# Altium schematic sheet Микроконтроллер_2024-10-30.schdoc
size 295 x 185 mm
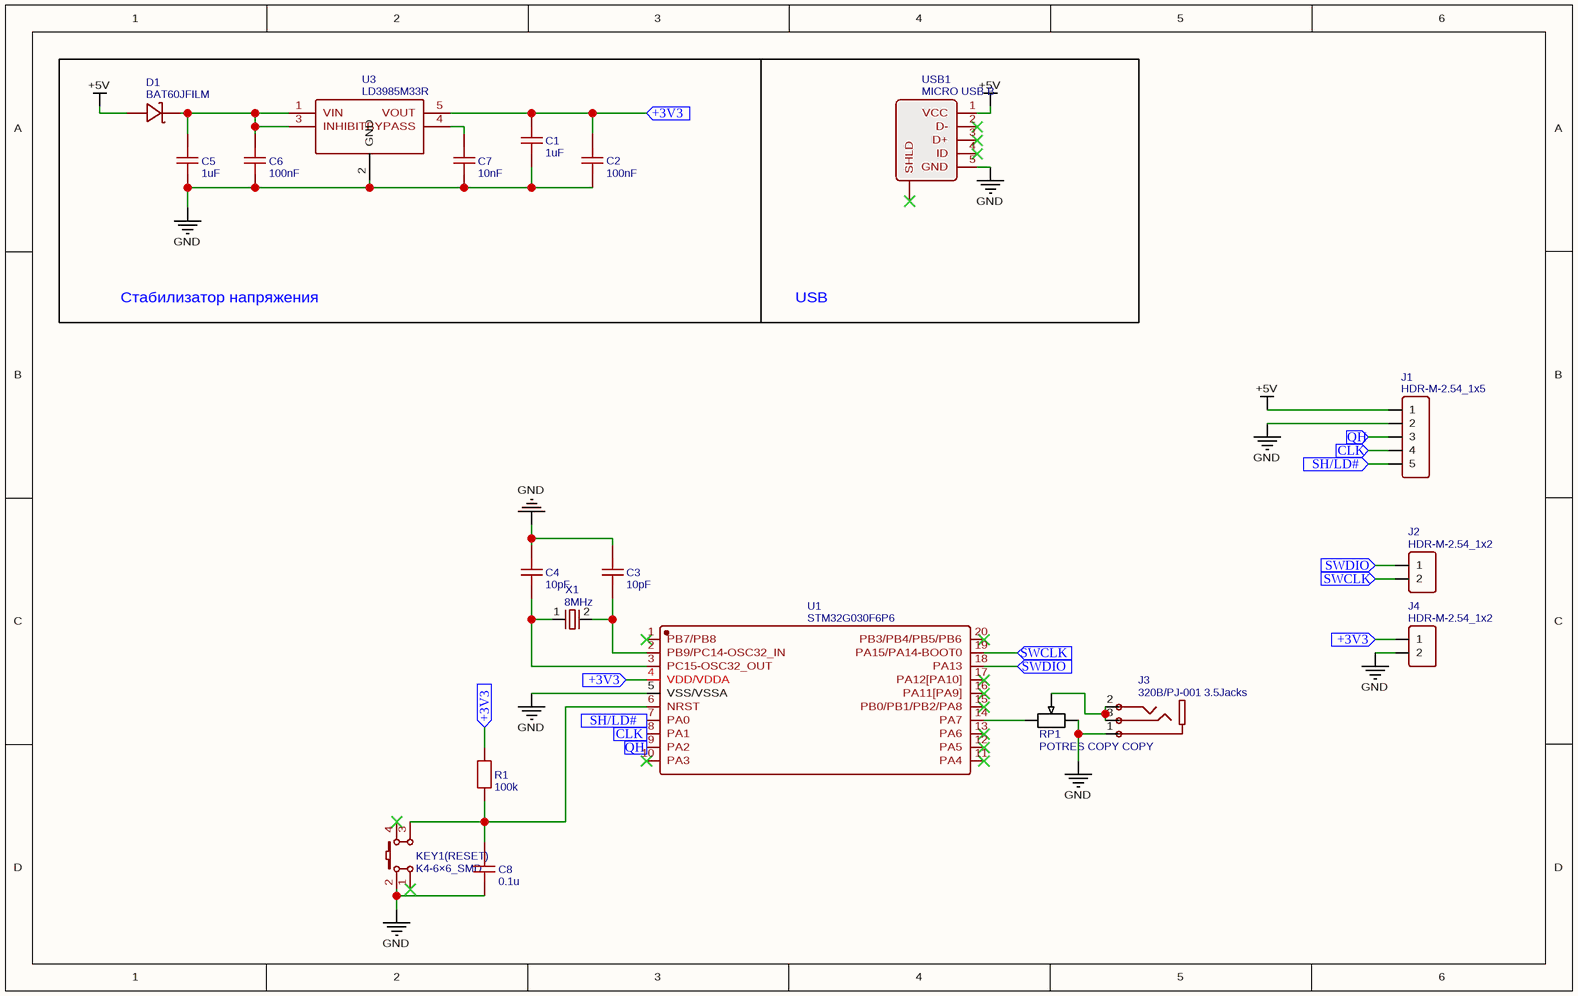
[diagram p0: Микроконтроллер_2024-10-30.schdoc]

## Parts
C1  1uF  [C0603]
C2  100nF  [C0603]
C3  10pF  [C0603]
C4  10pF  [C0603]
C5  1uF  [C0603]
C6  100nF  [C0603]
C7  10nF  [C0603]
C8  0.1u  [C0603]
D1  BAT60JFILM  [SOD-323_L1.8-W1.3-LS2.5-RD]
J1  HDR-M-2.54_1x5  [HDR-M-2.54_1X5]
J2  HDR-M-2.54_1x2  [HDR-M-2.54_1X2]
J3  320B/PJ-001 3.5Jacks  [AUDIO-SMD_C3792]
J4  HDR-M-2.54_1x2  [HDR-M-2.54_1X2]
KEY1(RESET)  K4-6×6_SMD  [KEY-SMD_4P-L6.0-W6.0-P3.90-LS10.0]
R1  100k  [R0603]
RP1  POTRES COPY COPY  [ПОТЕНЦИОМЕТР]
U1  STM32G030F6P6  [TSSOP-20_L6.5-W4.4-P0.65-LS6.4-BL]
U3  LD3985M33R  [SOT-23-5_L3.0-W1.7-P0.95-LS2.8-BR]
USB1  MICRO USB B  [GENERIC MICRO USB / MICRO-USB-SMD_MICRO-USB-16]
X1  8MHz  [OSC-SMD_2P-L3.2-W2.5]

## Blocks framed on the sheet
Стабилизатор напряжения: C1 C2 C5-C7 D1 U3
USB: USB1

## Ports
+3V3 (in), CLK (in), QH (in), SH/LD# (in), SWCLK (in), SWDIO (in)

## Nets
+5V: D1.2(A) J1.1 USB1.1(VCC)
GND: C1.1 C2.1 C3.1 C4.1 C5.1 C6.1 C7.1 C8.1 J1.2 J3.1 J4.2 KEY1(RESET).2 RP1.3 U1.5(VSS/VSSA) U3.2(GND) USB1.5(GND)
+3V3: C1.2 C2.2 J4.1 R1.2 U1.4(VDD/VDDA) U3.5(VOUT) ; port +3V3
CLK: J1.4 U1.8(PA1) ; port CLK
QH: J1.3 U1.9(PA2) ; port QH
SH/LD#: J1.5 U1.7(PA0) ; port SH/LD#
SWCLK: J2.2 U1.19(PA15/PA14-BOOT0) ; port SWCLK
SWDIO: J2.1 U1.18(PA13) ; port SWDIO
NetC3_2: C3.2 U1.2(PB9/PC14-OSC32_IN) X1.2(GND)
NetC4_2: C4.2 U1.3(PC15-OSC32_OUT) X1.1
NetC5_2: C5.2 C6.2 D1.1(K) U3.1(VIN) U3.3(INHIBIT)
NetC7_2: C7.2 U3.4(BYPASS)
NetC8_2: C8.2 KEY1(RESET).3 R1.1 U1.6(NRST)
NetJ3_2: J3.2 J3.3 RP1.2
NetRP1_1: RP1.1 U1.14(PA7)

Not connected (* = marked no-connect by the designer): KEY1(RESET) 1* 4*; U1 1(PB7/PB8)* 10(PA3)* 11(PA4)* 12(PA5)* 13(PA6)* 15(PB0/PB1/PB2/PA8)* 16(PA11[PA9])* 17(PA12[PA10])* 20(PB3/PB4/PB5/PB6)*; USB1 2(D-)* 3(D+)* 4(ID)* 6(SHLD)*

## Library data of the parts
C1 C5 = 1uF: nameAlias: Value(F); Contributor: LCEDA_Lib; spicePre: C; spiceSymbolName: C_0603_US
C2 C6 = 100nF: nameAlias: Value(F); Contributor: LCEDA_Lib; spicePre: C; spiceSymbolName: C_0603_US
C3 C4 = 10pF: nameAlias: Value(F); Contributor: LCEDA_Lib; spicePre: C; spiceSymbolName: C_0603_US
C7 = 10nF: nameAlias: Value(F); Contributor: LCEDA_Lib; spicePre: C; spiceSymbolName: C_0603_US
C8 = 0.1u: nameAlias: Value(F); Contributor: LCEDA_Lib; spicePre: C; spiceSymbolName: C_0603_US
D1 = BAT60JFILM: Manufacturer: ST(意法半导体); Contributor: LCSC; Supplier: LCSC; Manufacturer Part: BAT60JFILM; Supplier Part: C133103; JLCPCB Part Class: Extended Part; spicePre: D; spiceSymbolName: BAT60JFILM
J1 = HDR-M-2.54_1x5: Contributor: LCEDA_Lib; Supplier Part: C358687; Supplier: LCSC; spicePre: J; spiceSymbolName: HDR-M-2.54_1x5
J2 J4 = HDR-M-2.54_1x2: Contributor: LCEDA_Lib; Supplier Part: C124375; Supplier: LCSC; spicePre: J; spiceSymbolName: HDR-M-2.54_1x2
J3 = 320B/PJ-001 3.5Jacks: Manufacturer: ReliaPro; Supplier Part: C3792; Supplier: LCSC; Manufacturer Part: 320B/PJ-001 3.5Jacks; spicePre: J; spiceSymbolName: 320B/PJ-001 3.5Jacks
KEY1(RESET) = K4-6×6_SMD: Manufacturer: 韩国韩荣; Manufacturer Part: K2-6639SP-D4SC-04; Contributor: LCEDA_Lib; Supplier Part: C191626; Supplier: LCSC; spicePre: K; spiceSymbolName: K4-6×6_SMD
R1 = 100k: nameAlias: Value(Ω); Contributor: LCEDA_Lib; spicePre: R; spiceSymbolName: R_0603_EU
RP1 = POTRES COPY COPY: Contributor: ttnigmatyllin; spicePre: R; spiceSymbolName: POTRES COPY COPY
U1 = STM32G030F6P6: Manufacturer: ST(意法半导体); Contributor: LCSC; Supplier: LCSC; Supplier Part: C724040; Manufacturer Part: STM32G030F6P6; JLCPCB Part Class: Extended Part; spicePre: U; spiceSymbolName: STM32G030F6P6
U3 = LD3985M33R: Manufacturer: ST(意法半导体); Supplier: LCSC; Manufacturer Part: LD3985M33R; Supplier Part: C46243; JLCPCB Part Class: Extended Part; spicePre: U; spiceSymbolName: LD3985M33R
USB1 = MICRO USB B: Manufacturer: HRO; Manufacturer Part: U-F-M5SW-Y-3; Supplier: LCSC; Supplier Part: C106820; JLCPCB Part Class: Extended Part; spicePre: U; spiceSymbolName: MICRO USB B
X1 = 8MHz: Manufacturer: NDK; Manufacturer Part: NX3225GD-8MHZ-STD-CRA-3; Contributor: LCSC; nameAlias: Value; Supplier: LCSC; Supplier Part: C889706; JLCPCB Part Class: Extended Part; spicePre: X; spiceSymbolName: NX3225GD-8MHZ-STD-CRA-3